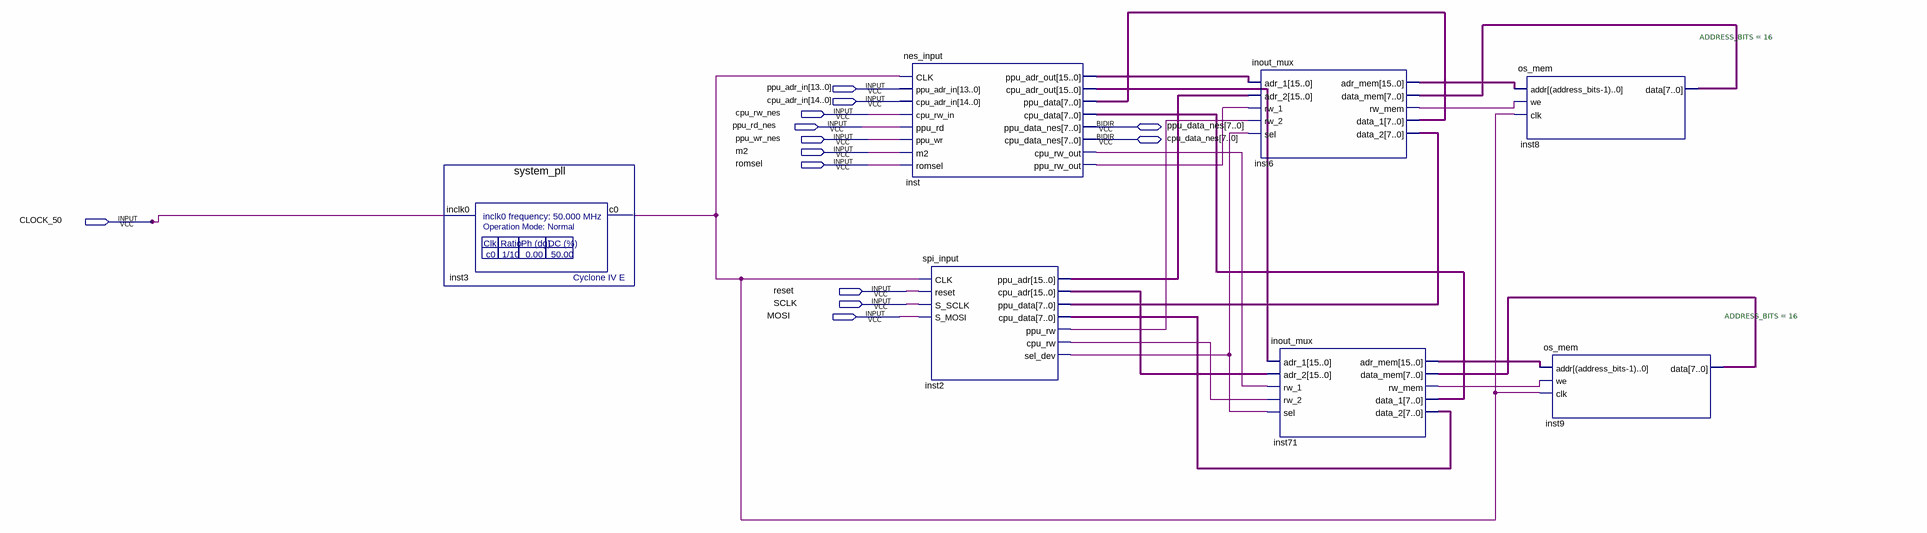
[diagram p0: schematic sheet]
// Quartus schematic system.bdf as structural Verilog: 7 symbols, 13 pins
module system (
  input  [13:0] ppu_adr_in,
  input  [14:0] cpu_adr_in,
  input  cpu_rw_nes,
  input  ppu_rd_nes,
  input  ppu_wr_nes,
  input  m2,
  input  romsel,
  input  CLOCK_50,
  input  reset,
  input  SCLK,
  input  MOSI,
  inout  [7:0] ppu_data_nes,
  inout  [7:0] cpu_data_nes
);

  wire inst2_cpu_rw, inst2_ppu_rw, inst2_sel_dev, inst3_c0, inst6_rw_mem, inst71_rw_mem, inst_cpu_rw_out,
       inst_ppu_rw_out;
  wire [7:0] inst2_cpu_data, inst2_ppu_data, inst6_data_mem, inst71_data_mem, inst_cpu_data, inst_ppu_data;
  wire [15:0] inst2_cpu_adr, inst2_ppu_adr, inst6_adr_mem, inst71_adr_mem, inst_cpu_adr_out, inst_ppu_adr_out;

  system_pll inst3 (.inclk0(CLOCK_50), .c0(inst3_c0));
  nes_input inst (
    .CLK(inst3_c0), .ppu_adr_in(ppu_adr_in), .cpu_adr_in(cpu_adr_in), .cpu_rw_in(cpu_rw_nes),
    .ppu_rd(ppu_rd_nes), .ppu_wr(ppu_wr_nes), .m2(m2), .romsel(romsel), .ppu_adr_out(inst_ppu_adr_out),
    .cpu_adr_out(inst_cpu_adr_out), .cpu_rw_out(inst_cpu_rw_out), .ppu_rw_out(inst_ppu_rw_out),
    .ppu_data(inst_ppu_data), .cpu_data(inst_cpu_data), .ppu_data_nes(ppu_data_nes),
    .cpu_data_nes(cpu_data_nes));
  spi_input inst2 (
    .CLK(inst3_c0), .reset(reset), .S_SCLK(SCLK), .S_MOSI(MOSI), .ppu_adr(inst2_ppu_adr),
    .cpu_adr(inst2_cpu_adr), .ppu_rw(inst2_ppu_rw), .cpu_rw(inst2_cpu_rw), .sel_dev(inst2_sel_dev),
    .ppu_data(inst2_ppu_data), .cpu_data(inst2_cpu_data));
  inout_mux inst6 (
    .adr_1(inst_ppu_adr_out), .adr_2(inst2_ppu_adr), .rw_1(inst_ppu_rw_out), .rw_2(inst2_ppu_rw),
    .sel(inst2_sel_dev), .adr_mem(inst6_adr_mem), .rw_mem(inst6_rw_mem), .data_mem(inst6_data_mem),
    .data_1(inst_ppu_data), .data_2(inst2_ppu_data));
  inout_mux inst71 (
    .adr_1(inst_cpu_adr_out), .adr_2(inst2_cpu_adr), .rw_1(inst_cpu_rw_out), .rw_2(inst2_cpu_rw),
    .sel(inst2_sel_dev), .adr_mem(inst71_adr_mem), .rw_mem(inst71_rw_mem), .data_mem(inst71_data_mem),
    .data_1(inst_cpu_data), .data_2(inst2_cpu_data));
  os_mem #(.ADDRESS_BITS(16)) inst8 (.addr(inst6_adr_mem), .we(inst6_rw_mem), .clk(inst3_c0), .data(inst6_data_mem));
  os_mem #(.ADDRESS_BITS(16)) inst9 (.addr(inst71_adr_mem), .we(inst71_rw_mem), .clk(inst3_c0), .data(inst71_data_mem));
endmodule
